# EAGLE design receiver (EAGLE 7.6.0)
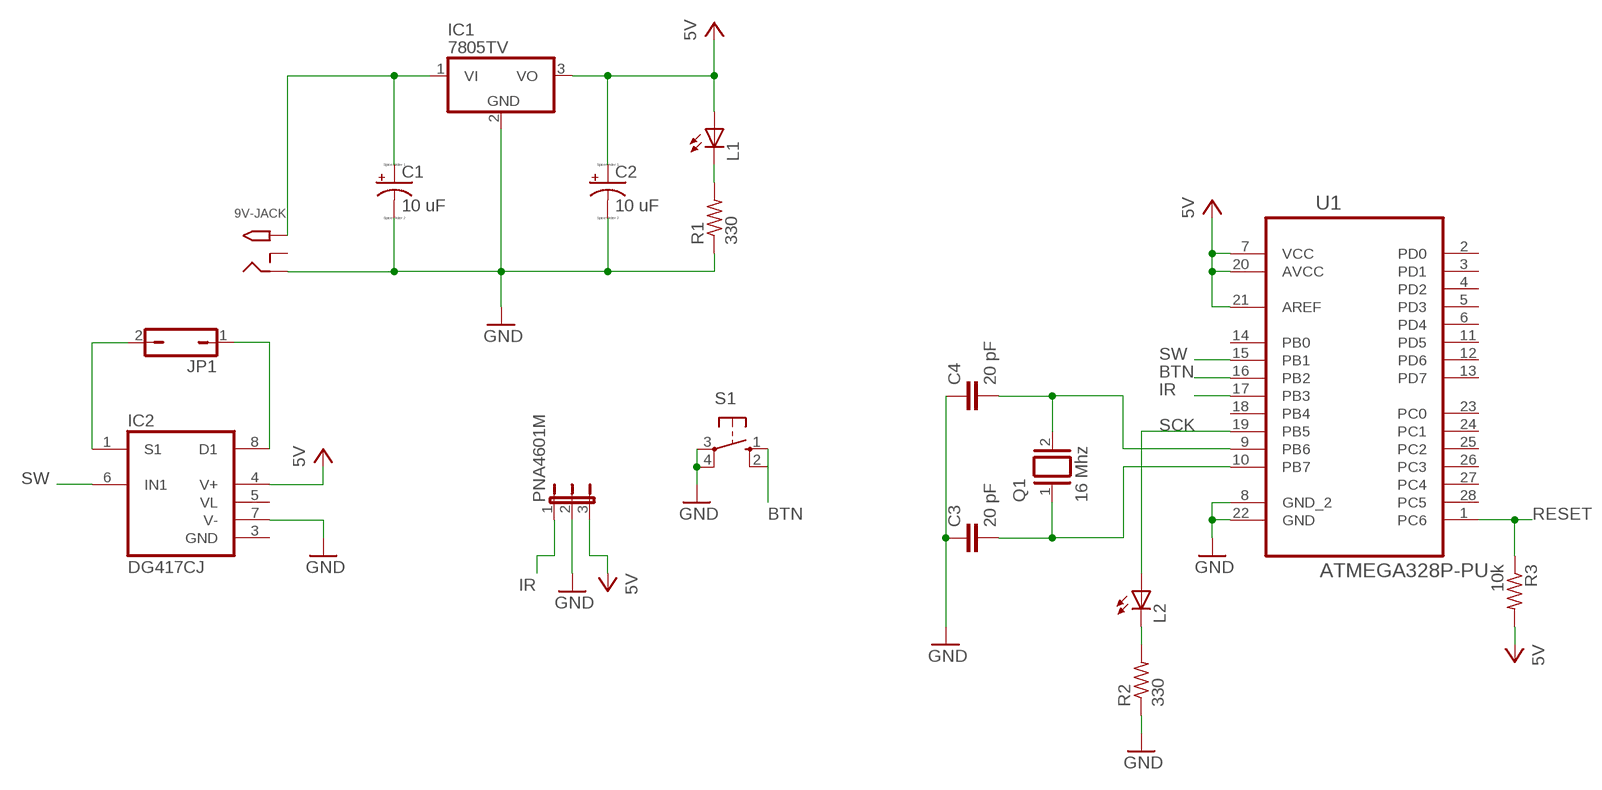
[diagram p0: schematic, sheet 1]

## Parts
9V-JACK  9V Input  2.1MMJACKTHM  [PJ-102A]
C1  10 uF  CPOL-USB45181B  [B45181B]
C2  10 uF  CPOL-USB45181B  [B45181B]
C3  20 pF  C-EU050-025X075  [C050-025X075]
C4  20 pF  C-EU050-025X075  [C050-025X075]
IC1  7805TV  [TO220V]
IC2  DG417CJ  [DIL08]
JP1  JP1Q  [JP1]
L1  LED3MM  [LED3MM]
L2  LED3MM  [LED3MM]
PNA4601M  JP2E  [JP2]
Q1  16 Mhz  XTAL/S  [QS]
R1  330  RESISTOR0309/10  [RES400MIL]
R2  330  RESISTOR0309/10  [RES400MIL]
R3  10k  RESISTOR0309/10  [RES400MIL]
S1  B3F-1052  [B3F-10XX]
U1  ATMEGA328P-PU  [DIP254P762X457-28]

## Nets
5V [power]: C2.+ IC1.3(VO) IC2.4(V+) L1.A PNA4601M.3 R3.2 U1.7(VCC) U1.20(AVCC) U1.21(AREF)
BTN: S1.1(S) U1.16(PB2)
GND [power]: 9V-JACK.RING C1.- C2.- C3.1 C4.1 IC1.2(GND) IC2.7(V-) PNA4601M.2 R1.1 R2.1 S1.3(P) S1.4(P1) U1.8(GND_2) U1.22(GND)
IR: PNA4601M.1 U1.17(PB3)
N$2: L1.K(C) R1.2
N$3: IC2.1(S1) JP1.2
N$4: C3.2 Q1.1 U1.10(PB7)
N$5: C4.2 Q1.2 U1.9(PB6)
N$6: IC2.8(D1) JP1.1
N$7 [power]: 9V-JACK.TIP C1.+ IC1.1(VI)
N$9: L2.K(C) R2.2
RESET: R3.1 U1.1(PC6)
SCK: L2.A U1.19(PB5)
SW: IC2.6(IN1) U1.15(PB1)
Unconnected: 9V-JACK.RING_SW S1.2(S1) U1.2(PD0) U1.3(PD1) U1.4(PD2) U1.5(PD3) U1.6(PD4) U1.11(PD5) U1.12(PD6) U1.13(PD7) U1.14(PB0) U1.18(PB4) U1.23(PC0) U1.24(PC1) U1.25(PC2) U1.26(PC3) U1.27(PC4) U1.28(PC5)

## Power pins joined to a net without a drawn wire
GND: IC2.3(GND)
VL: IC2.5(VL)

## Library data of the parts
9V-JACK = adafruit:2.1MMJACK: 2.1mm x 5.5mm THM DC jack with internal switch. Digikey part #PJ-102A, 4UCON part #05537 2.1mm x 5.5mm SMT DC jack with internal switch. Digikey part #PJ-002A-SMT, 4UCON part #03267 By microbuilder.eu & adafruit.com
C1 C2 = resistor:CPOL-US: POLARIZED CAPACITOR, American symbol
C3 C4 = resistor:C-EU: CAPACITOR, European symbol
IC1 = linear:78*: Positive VOLTAGE REGULATOR Source: http://cache.national.com/ds/LM/LM78L05.pdf http://www.fairchildsemi.com/ds/LM/LM7805.pdf
IC2 = maxim:DG417CJ: ANALOG SWITCH; OC_FARNELL: unknown; OC_NEWARK: unknown
JP1 = jumper:JP1Q: JUMPER
L1 L2 = EE445L:LED: Avago Technologies LED Green 2mA 5mm diffused, HLMP-4740, Digikey 516-1327-ND Red 1.6V 1mA 5mm diffused, HLMP-D150, Digikey 516-1323-ND Yellow 2mA 5mm diffused, HLMP-4719, Digikey 516-1326-ND Orange 10mA 5mm diffused HLMP-D401, Digikey 516-1330-ND Blue 10mA 5mm diffused
PNA4601M = jumper:JP2E: JUMPER
Q1 = special:XTAL/S: CRYSTAL
R1-R3 = EE445L:RESISTOR: RESISTOR, American symbol
S1 = EE445L:B3F-1052: OMRON SWITCH 1.1mm holes; MPN: B3F-1000; OC_FARNELL: 176432; OC_NEWARK: 36M3542
U1 = Atmel_By_element14_Batch_1-00:ATMEGA328P-PU: 8-bit Microcontroller with In-System Programmable Flash; MPN: ATMEGA328P-PU; OC_FARNELL: 1715487; OC_NEWARK: 15R0268; PACKAGE: PDIP-28; SUPPLIER: Atmel

## Net classes
0 default: width 0.406 mm, clearance 0.254 mm
1 power: width 0.61 mm, clearance 0.406 mm

## Board
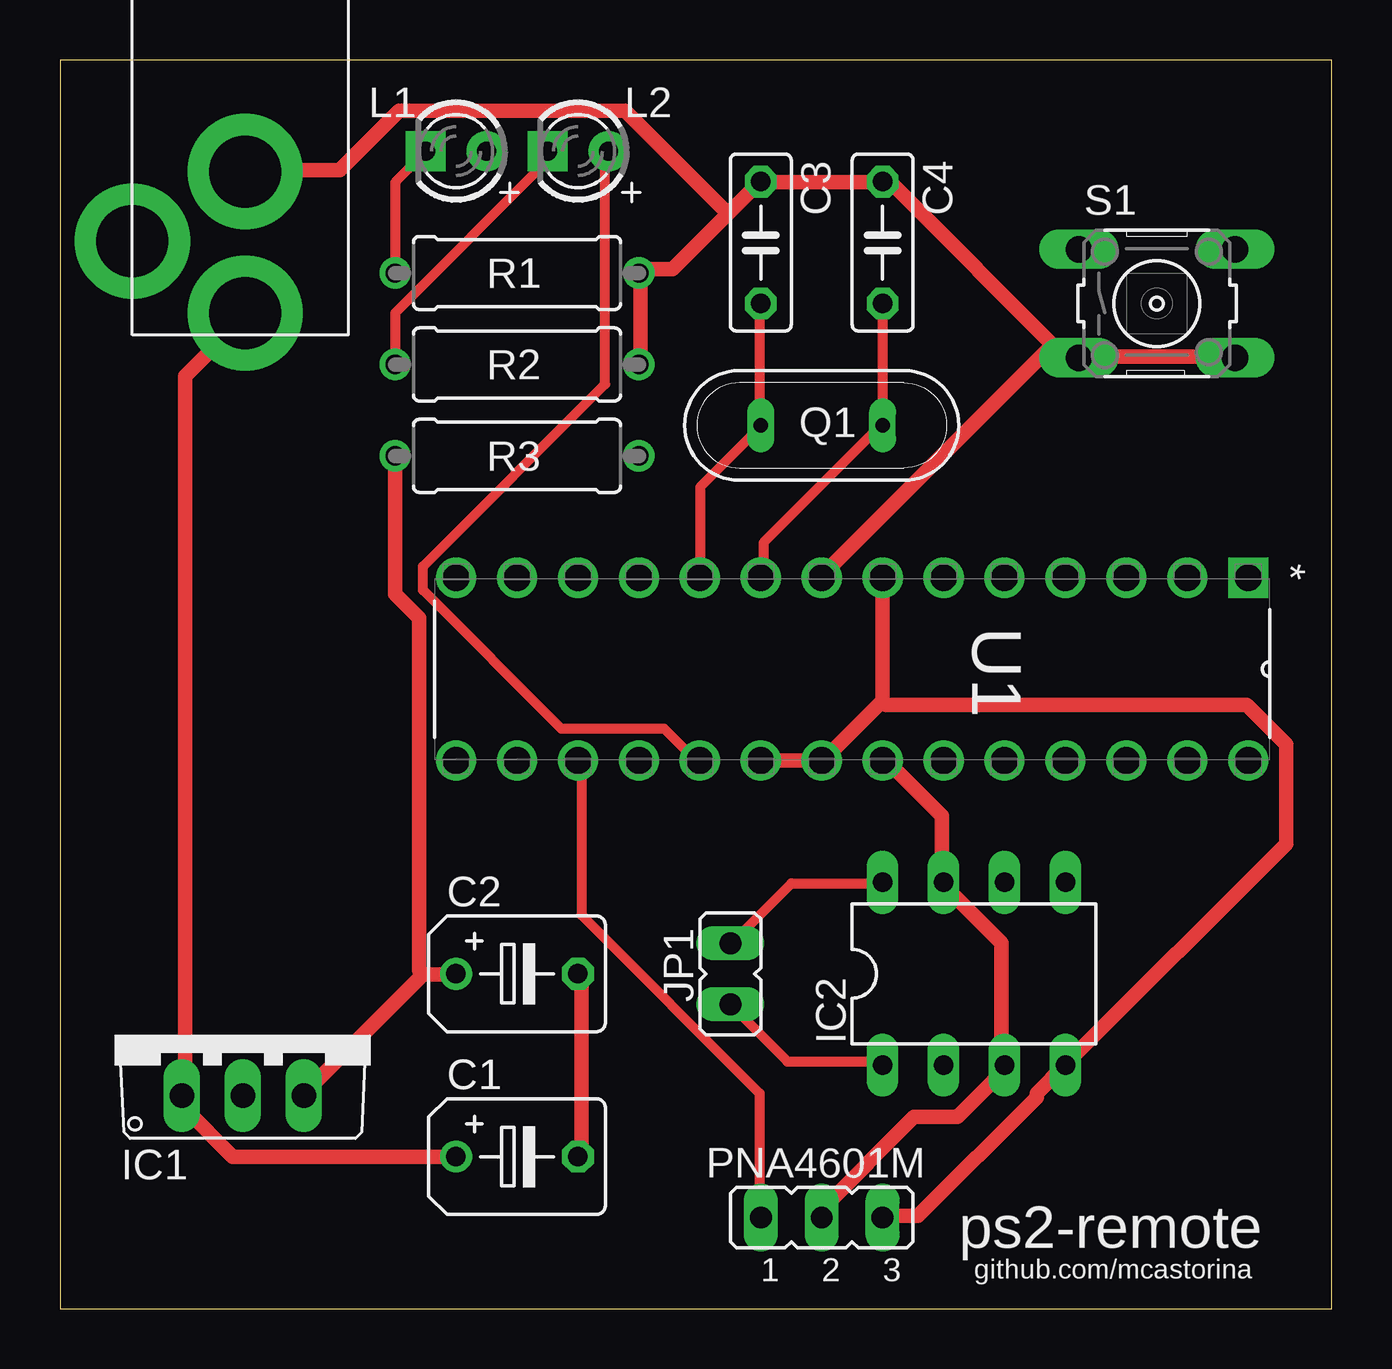
[diagram p1: board, top side]
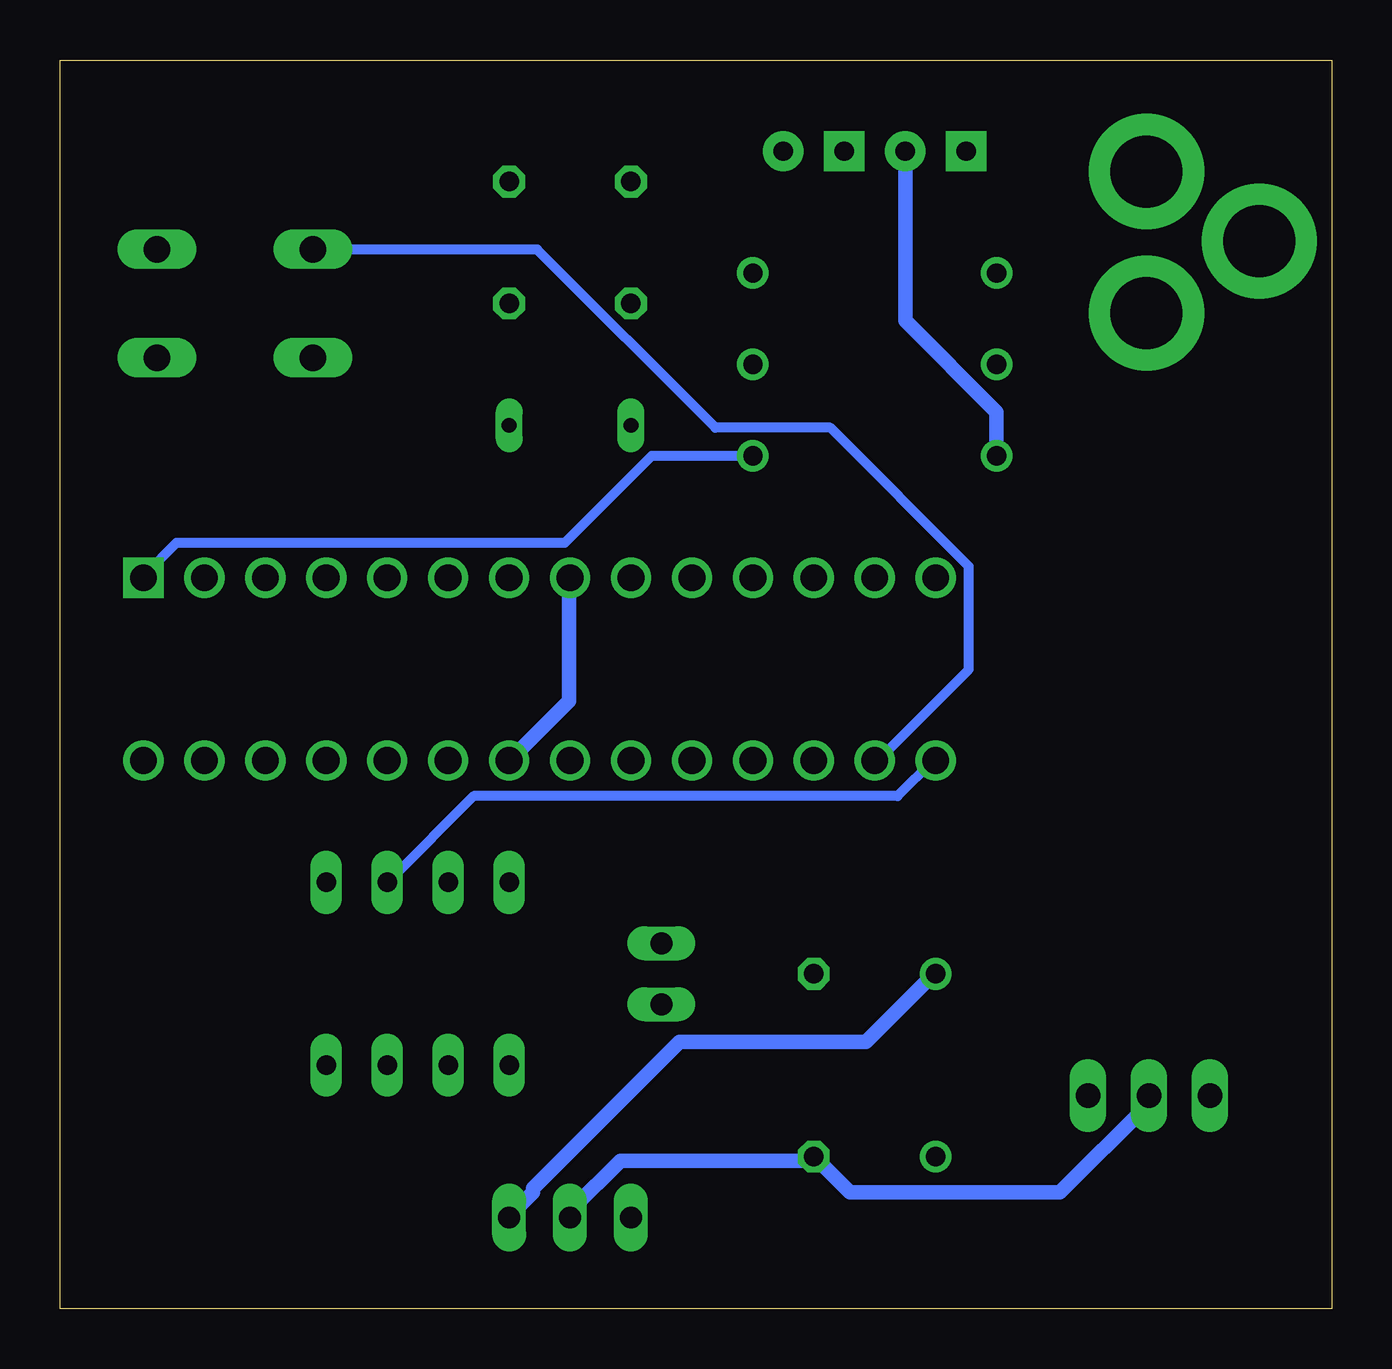
[diagram p2: board, bottom side, seen from below]

Size 53.01 x 52.06 mm. Coordinates in mm from the lower left corner, seen from the top.
Outline: 0,0 53.01,0 53.01,52.06 0,52.06 0,0
Copper layers (1*16): Top 0.035mm / dielectric 1.5mm / Bottom 0.035mm
Design rules "default": minimum track width 10mil, minimum drill 24mil, track to track 8mil, track to pad 8mil, pad to pad 8mil, via to via 8mil, smd to smd 8mil, copper to edge 40mil, drill to drill 8mil, minimum pad ring 10mil, minimum via ring 8mil, stop-mask expansion 4mil, vias tented up to drill 0mil, thermal gap 10mil

### Footprints (pad centres in the part's own frame; a part is rotated, then mirrored left to right if it is on the bottom)
PJ-102A = drill 3 pad 4.8: RING 0.1,-3.39; RING_SW -4.6,-6.29; TIP 0.1,-9.29
B45181B = drill 0.813: + -2.54,0 | drill 0.813 octagon: - 2.54,0
C050-025X075 = drill 0.813 octagon: 1 -2.54,0; 2 2.54,0
TO220V = drill 1.016 long: 1 -2.54,-2.54; 2 0,-2.54; 3 2.54,-2.54
DIL08 = drill 0.813 long: 1 -3.81,-3.81; 2 -1.27,-3.81; 3 1.27,-3.81; 4 3.81,-3.81; 5 3.81,3.81; 6 1.27,3.81; 7 -1.27,3.81; 8 -3.81,3.81
JP1 = drill 0.914 long: 1 0,-1.27; 2 0,1.27
LED3MM = drill 0.8 pad 1.676: A -1.27,0 | drill 0.8 pad 1.676 square: K 1.27,0
JP2 = drill 0.914 long: 1 -2.54,0; 2 0,0; 3 2.54,0
QS = drill 0.61 long: 1 -2.54,0; 2 2.54,0
RES400MIL = drill 0.8: 1 -5.08,0; 2 5.08,0
B3F-10XX = drill 1.1 long: 1 -3.251,2.261; 2 3.251,2.261; 3 -3.251,-2.261; 4 3.251,-2.261
DIP254P762X457-28 = drill 1.118 square: 1 -7.62,33.02 | drill 1.118: 2 -7.62,30.48; 3 -7.62,27.94; 4 -7.62,25.4; 5 -7.62,22.86; 6 -7.62,20.32; 7 -7.62,17.78; 8 -7.62,15.24; 9 -7.62,12.7; 10 -7.62,10.16; 11 -7.62,7.62; 12 -7.62,5.08; 13 -7.62,2.54; 14 -7.62,0; 15 0,0; 16 0,2.54; 17 0,5.08; 18 0,7.62; 19 0,10.16; 20 0,12.7; 21 0,15.24; 22 0,17.78; 23 0,20.32; 24 0,22.86; 25 0,25.4; 26 0,27.94; 27 0,30.48; 28 0,33.02

### Placement (x,y rotation side)
9V-JACK  7.62,50.8 0 top
C1  19.05,6.35 0 top
C2  19.05,13.97 0 top
C3  29.21,44.45 270 top
C4  34.29,44.45 270 top
IC1  7.62,11.43 0 top
IC2  38.1,13.97 0 top
JP1  27.94,13.97 180 top
L1  16.51,48.26 180 top
L2  21.59,48.26 180 top
PNA4601M  31.75,3.81 0 top
Q1  31.75,36.83 0 top
R1  19.05,43.18 180 top
R2  19.05,39.37 180 top
R3  19.05,35.56 180 top
S1  45.72,41.91 0 top
U1  16.51,22.86 270 top

### Tracks (layer width: path | path; a pad name or v marks a point on that pad's centre or on a via)
5V
  Top 0.61: U1.20 U1.21 31.97,23.03 34.28,25.34 | 34.28,25.34 34.28,30.46 U1.7 | PNA4601M.3 34.44,3.87 35.76,3.87 40.72,8.83 40.72,8.99 41.87,10.15 IC2.4 42.04,10.31 51.12,19.39 51.12,23.52 49.47,25.17 34.44,25.17 34.28,25.34 | 15.13,13.95 16.45,13.95 C2.+ | 15.13,13.95 10.17,8.99 IC1.3 | 15.13,13.95 14.96,14.11 14.96,28.8 13.97,29.79 R3.2
  Bottom 0.61: L1.A 17.77,48.12 17.77,41.19 13.97,37.39 R3.2 | PNA4601M.3 34.28,3.87 33.29,4.86 33.29,5.03 27.18,11.14 19.42,11.14 16.61,13.95 C2.+
BTN
  Bottom 0.406: S1.1 42.37,44.16 33.12,44.16 25.69,36.73 20.9,36.73 15.13,30.95 15.13,26.66 18.92,22.86 U1.16
GND
  Top 0.61: C1.- 21.73,6.35 21.73,13.95 C2.- | U1.22 34.44,22.86 36.75,20.55 36.75,17.91 IC2.7 36.92,17.58 39.23,15.27 39.23,10.31 IC2.3 39.4,9.98 37.41,8 35.6,8 31.8,4.2 31.8,3.87 PNA4601M.2 | S1.3 42.53,39.7 48.97,39.7 S1.4 | R2.1 24.21,39.37 24.21,43.17 R1.1 24.37,43.33 25.53,43.33 27.84,45.64 | 27.84,45.64 28.99,46.8 C3.1 29.32,46.97 34.28,46.97 C4.1 34.61,46.97 41.87,39.7 42.2,39.7 S1.3 | 27.84,45.64 23.55,49.94 14.14,49.94 11.66,47.46 7.86,47.46 9V-JACK.RING | U1.8 31.8,30.62 41.21,40.03 S1.3
  Bottom 0.61: IC1.2 7.7,8.83 7.7,8.5 11.33,4.86 20.08,4.86 21.57,6.35 C1.- 21.73,6.18 29.65,6.18 31.64,4.2 31.64,3.87 PNA4601M.2 | U1.8 31.8,30.46 31.8,25.34 34.28,22.86 U1.22
IR
  Top 0.406: PNA4601M.1 29.16,3.87 29.16,8.99 21.73,16.42 21.73,22.86 U1.17
N$2
  Top 0.406: R1.2 13.97,46.97 15.13,48.12 L1.K
N$3
  Top 0.406: IC2.1 34.28,10.31 30.31,10.31 28,12.62 JP1.2
N$4
  Top 0.406: C3.2 29.16,41.85 29.16,36.89 Q1.1 29.16,36.73 26.68,34.25 26.68,30.62 U1.10
N$5
  Top 0.406: C4.2 34.28,41.85 34.28,36.89 Q1.2 34.11,36.73 29.32,31.94 29.32,30.62 U1.9
N$6
  Top 0.406: IC2.8 34.28,17.74 30.48,17.74 28,15.27 JP1.1
N$7
  Top 0.61: C1.+ 7.2,6.35 5.22,8.33 5.22,8.83 IC1.1 5.22,9.16 5.22,38.88 7.7,41.35 9V-JACK.TIP
N$9
  Top 0.406: R2.2 13.97,41.52 20.24,47.79 20.24,48.12 L2.K
RESET
  Bottom 0.406: U1.1 49.47,30.62 48.15,31.94 31.97,31.94 28.35,35.56 R3.1
SCK
  Top 0.406: L2.A 22.72,48.12 22.72,38.55 15.13,30.95 15.13,29.96 20.9,24.18 25.2,24.18 26.52,22.86 U1.19
SW
  Bottom 0.406: IC2.6 39.23,17.91 35.76,21.37 18.1,21.37 16.61,22.86 U1.15

### Text on the board
tNames: ps2-remote | github.com/mcastorina